# EAGLE design working (EAGLE 8.7.0)
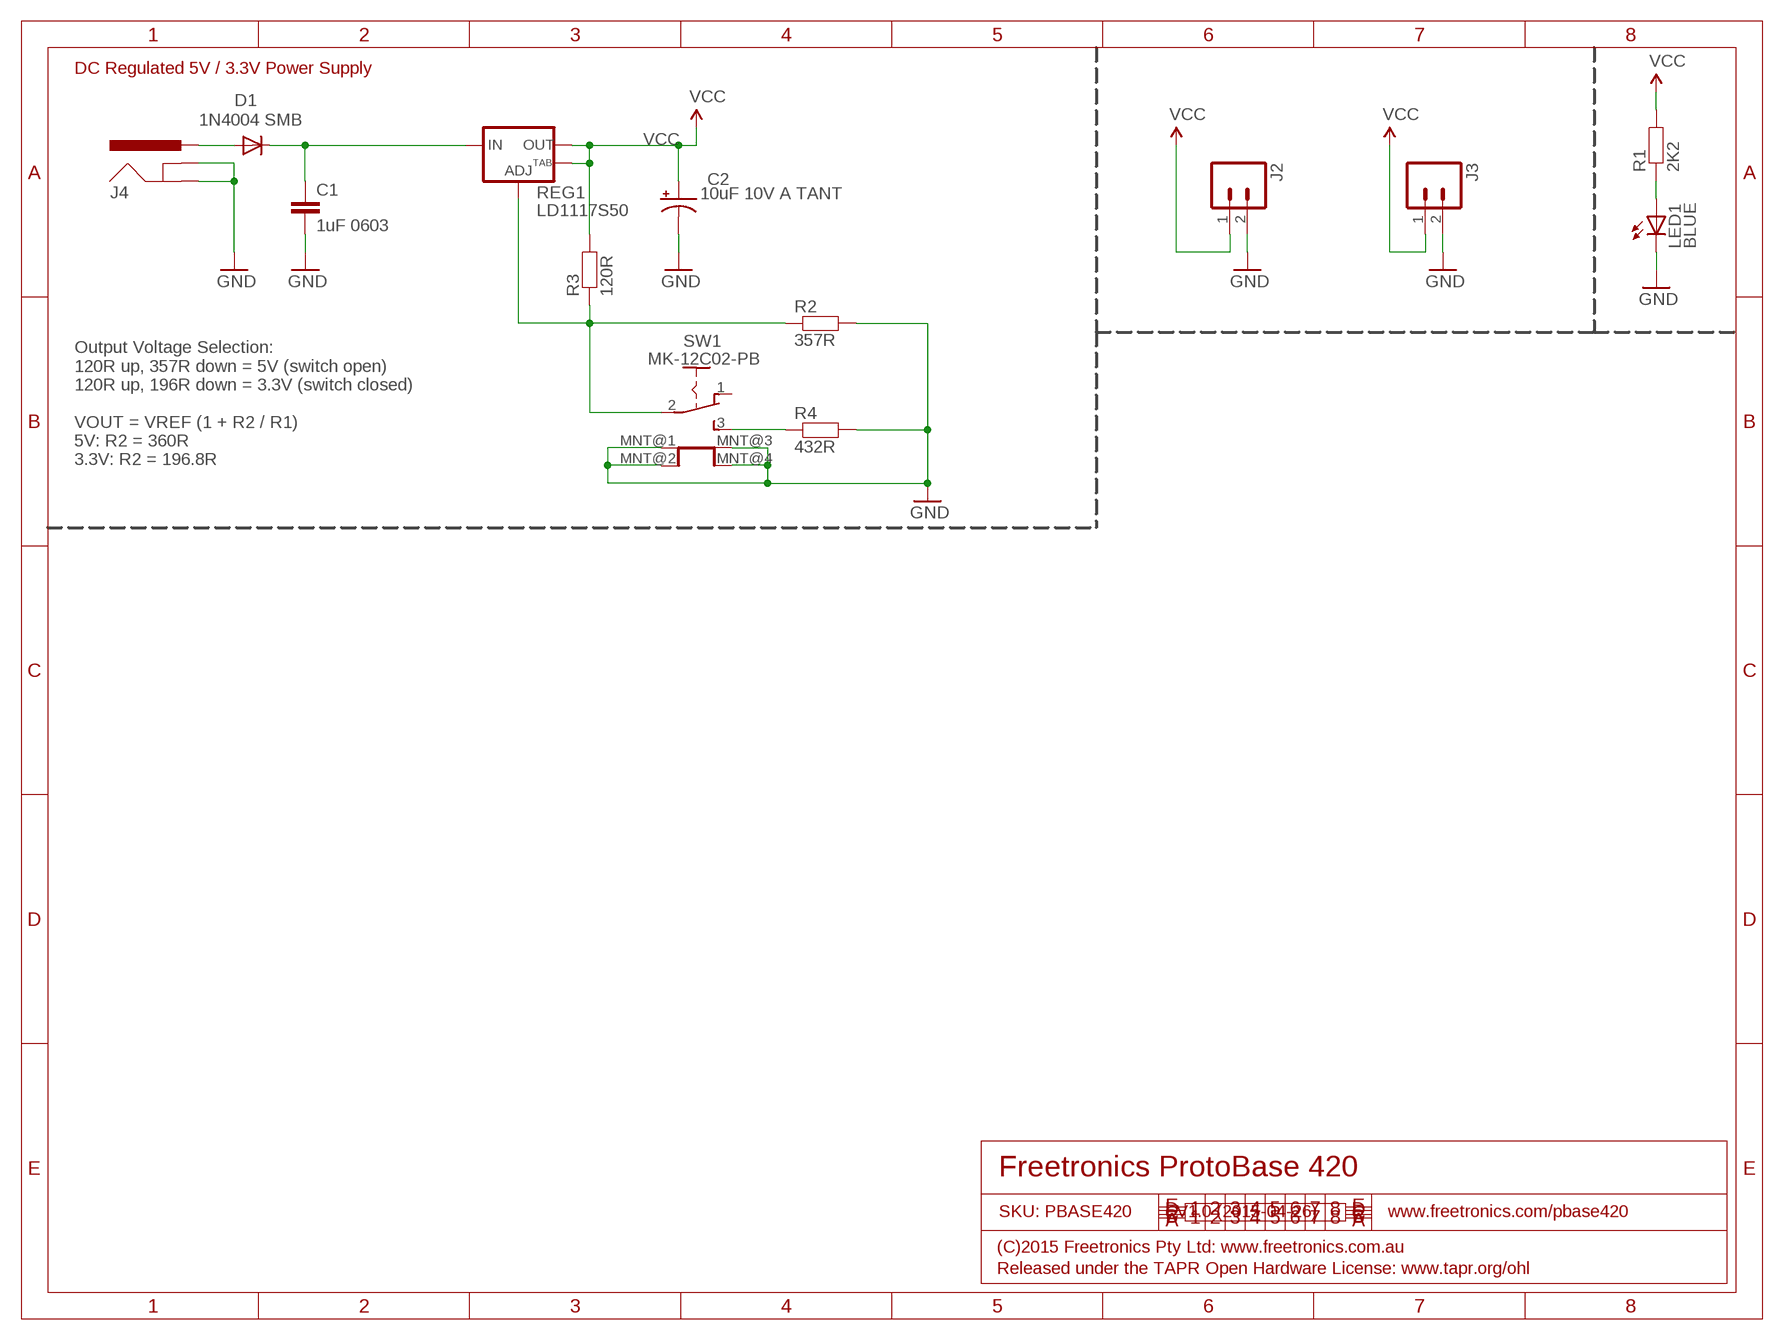
[diagram p0: schematic, sheet 1]

## Parts
C1  1uF 0603  CAP0603  [0603]
C2  10uF 10V A TANT  CAP_POL1206  [EIA3216]
D1  1N4004 SMB  DIODESMB  [SMB-DIODE]
J2  M02PTH  [1X02]
J3  M02PTH  [1X02]
J4  POWER_JACKPTH_SLOTS  [POWER_JACK_PTH_SLOTS]
LED1  BLUE  LED0603  [LED-0603]
R1  2K2  RESISTOR0603  [0603]
R2  357R  RESISTOR0603  [0603]
R3  120R  RESISTOR0603  [0603]
R4  432R  RESISTOR0603  [0603]
REG1  LD1117S50  V_REG_LM1117SOT223  [SOT223]
SW1  MK-12C02-PB  SWITCH-SPDT-4TABSSMT  [MK-12C02]

## Nets
GND: C1.2 C2.C(-) J2.2 J3.2 J4.GND J4.GNDBREAK LED1.C R2.2 R4.2 SW1.MNT@1(MNT) SW1.MNT@2(MNT) SW1.MNT@3(MNT) SW1.MNT@4(MNT)
N$1: LED1.A R1.1
N$2: R2.1 R3.1 REG1.1(ADJ) SW1.2(COM)
N$3: R4.1 SW1.3(B)
N$8: D1.A J4.PWR
VCC: C2.A(+) J2.1 J3.1 R1.2 R3.2 REG1.2(OUT) REG1.4(OUT)
VIN: C1.1 D1.C REG1.3(IN)
Unconnected: SW1.1(A)

## Notes on the sheet
- DC Regulated 5V / 3.3V Power Supply
- Output Voltage Selection:
  120R up, 357R down = 5V (switch open)
  120R up, 196R down = 3.3V (switch closed)
  
  VOUT = VREF (1 + R2 / R1)
  5V: R2 = 360R
  3.3V: R2 = 196.8R
- Freetronics ProtoBase 420
- SKU: PBASE420 | V1.0 (2015-04-26) | www.freetronics.com/pbase420
- (C)2015 Freetronics Pty Ltd: www.freetronics.com.au
- Released under the TAPR Open Hardware License: www.tapr.org/ohl

## Library data of the parts
C1 = freetronics-master-v1.1:CAP: Capacitor Standard 0603 ceramic capacitor, and 0.1" leaded capacitor.
C2 = freetronics:CAP_POL: Capacitor Polarized These are standard SMD and PTH capacitors. Normally 10uF, 47uF, and 100uF in electrolytic and tantalum varieties. Always verify the external diameter of the through hole cap, it varies with capacity, voltage, and manufacturer. The EIA devices should be standard.
D1 = freetronics:DIODE: Diode These are standard reverse protection diodes and small signal diodes. SMA package can handle up to about 1A. SOD-323 can handle about 200mA. What the SOD-323 package when ordering, there are some mfgs out there that are 5-pin packages.
J2 J3 = freetronics-original:M02: Header 2 Standard 2-pin 0.1" header. Use with straight break away headers (SKU : PRT-00116), right angle break away headers (PRT-00553), swiss pins (PRT-00743), machine pins (PRT-00117), and female headers (PRT-00115). Molex polarized connector foot print use with SKU : PRT-08233 with associated crimp pins and housings.
J4 = freetronics-jon:POWER_JACK: Power Jack This is the standard 5.5mm barrel jack for power. The PTH is the most common, proven, reliable, footprint. All others are experimental. The Slot footprint only works if the mill layer is transmitted to the PCB fab house so be warned. Spark Fun Electronics SKU : PRT-00119. Mating wall wart : TOL-00298 (and others)
LED1 = freetronics-jon:LED: LEDs Standard schematic elements and footprints for 5mm, 3mm, 1206, and 0603 sized LEDs. 5mm - Spark Fun Electronics SKU : COM-00529 (and others)
R1-R4 = freetronics-jon:RESISTOR: Resistor Basic schematic elements and footprints for 0603, 1206, and PTH 1/10th watt (small) resistors.
REG1 = freetronics-master-v1.1:V_REG_LM1117: Voltage Regulator LD1117 Adjustable low-dropout voltage regulator available in SOT89 and SOT223 SMT packages.
SW1 = freetronics-jon:SWITCH-SPDT-4TABS

## Net classes
0 default: width 0.152 mm, drill 0.241 mm, clearance 0.152 mm

## Board
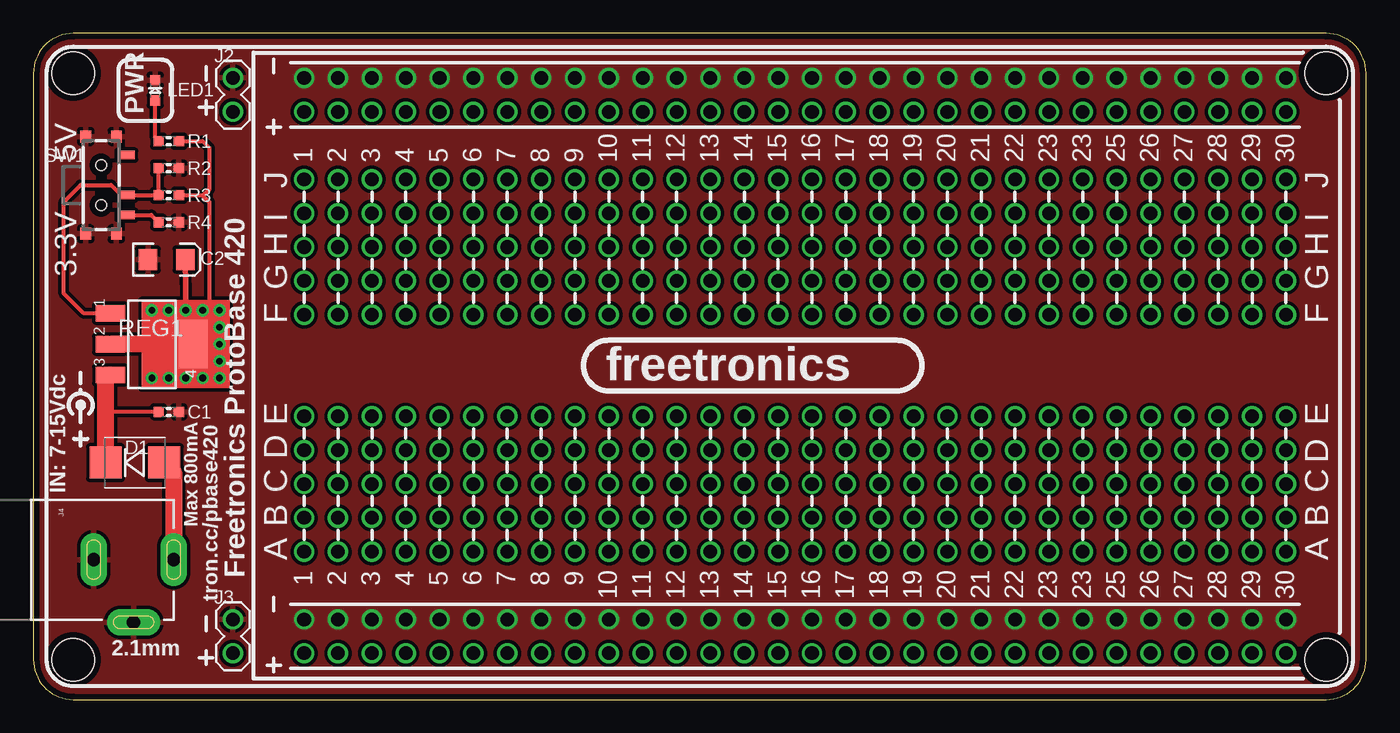
[diagram p1: board, top side]
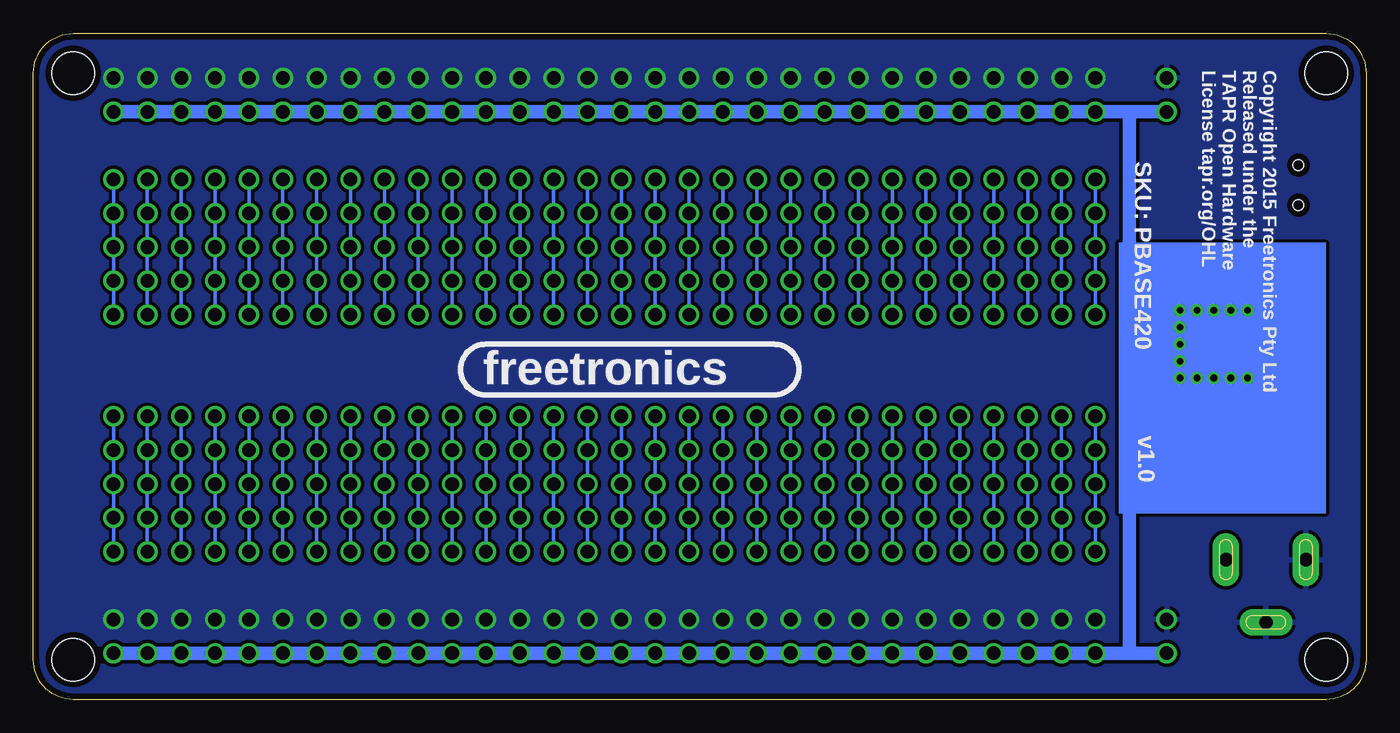
[diagram p2: board, bottom side, seen from below]

Size 100 x 50 mm. Coordinates in mm from the lower left corner, seen from the top.
Outline: 0,3 arc90 3,0 97,0 arc90 100,3 100,47 arc90 97,50 3,50 arc90 0,47 0,3
Copper layers (1*16): Top 0.035mm / dielectric 1.5mm / Bottom 0.035mm
Design rules "default": minimum track width 10mil, minimum drill 18mil, track to track 10mil, track to pad 10mil, pad to pad 10mil, via to via 10mil, smd to smd 8mil, copper to edge 18mil, drill to drill 8mil, minimum pad ring 10mil, minimum via ring 8mil, stop-mask expansion 4mil, vias tented up to drill 25mil, thermal gap 10mil
Holes 3.2 mm at 3,47 3,3 97,3 97,47

### Footprints (pad centres in the part's own frame; a part is rotated, then mirrored left to right if it is on the bottom)
0603 = smd 0.762 x 0.762: 1 -0.762,0; 2 0.762,0
EIA3216 = smd 1.4 x 1.6: A 1.4,0; C -1.4,0
SMB-DIODE = smd 2.4 x 2.4: A 2.2,0; C -2.2,0
1X02 = drill 1.016: 1 0,0; 2 2.54,0
POWER_JACK_PTH_SLOTS = drill 1 pad 2 long: GND 0,7.7; GNDBREAK 4.7,10.7; PWR 0,13.7
LED-0603 = smd 0.762 x 0.762: A -0.762,0; C 0.762,0
SOT223 = smd 1.219 x 2.235: 1 -2.311,-3.099; 2 0,-3.099; 3 2.311,-3.099 | smd 3.6 x 2.2: 4 0,3.099
MK-12C02 = smd 0.635 x 1.27: 1 -2.25,1.9; 2 0.75,1.9; 3 2.25,1.9 | smd 0.9 x 0.8: MNT@1 -3.65,1.15; MNT@2 -3.65,-1.15; MNT@3 3.65,1.15; MNT@4 3.65,-1.15 | hole 0.8: -1.5,0; 1.5,0

### Placement (x,y rotation side)
C1  10.16,21.59 0 top
C2  10,33.02 0 top
D1  7.62,17.78 0 top
J2  14.97,44.12 90 top
J3  14.97,3.48 90 top
J4  -3.17,10.5 270 top
LED1  9.14,45.72 90 top
R1  10.16,41.91 0 top
R2  10.16,39.88 0 top
R3  10.16,37.85 0 top
R4  10.16,35.81 0 top
REG1  8.89,26.67 270 top
SW1  5.08,38.61 270 top

### Tracks (layer width: path | path; a pad name or v marks a point on that pad's centre or on a via)
GND  (via drill 1.02)
  other vias: 20.32,6.01 22.86,6.01 25.4,6.01 27.94,6.01 30.48,6.01 33.02,6.01 35.56,6.01 38.1,6.01 40.64,6.01 43.18,6.01 45.72,6.01 48.26,6.01 50.8,6.01 53.34,6.01 55.88,6.01 58.42,6.01 60.96,6.01 63.5,6.01 66.04,6.01 68.58,6.01 71.12,6.01 73.66,6.01 76.2,6.01 78.74,6.01 81.28,6.01 83.82,6.01 86.36,6.01 88.9,6.01 91.44,6.01 93.98,6.01 20.32,46.66 22.86,46.66 25.4,46.66 27.94,46.66 30.48,46.66 33.02,46.66 35.56,46.66 38.1,46.66 40.64,46.66 43.18,46.66 45.72,46.66 48.26,46.66 50.8,46.66 53.34,46.66 55.88,46.66 58.42,46.66 60.96,46.66 63.5,46.66 66.04,46.66 68.58,46.66 71.12,46.66 73.66,46.66 76.2,46.66 78.74,46.66 81.28,46.66 83.82,46.66 86.36,46.66 88.9,46.66 91.44,46.66 93.98,46.66
  pour Bottom: 0,47 arc-90 3,50 97,50 arc-90 100,47 100,3 arc-74 97,0 3,0 arc-90 0,3
  pour Top: 0,47 arc-90 3,50 97,50 arc-90 100,47 100,3 arc-74 97,0 3,0 arc-90 0,3
N$1
  Top 0.254: R1.1 9.14,42.16
  Top 0.305: 9.14,42.16 LED1.A
N$2
  Top 0.254: 9.39,37.86 R3.1 | 6.59,37.86 SW1.2
  Top 0.305: REG1.1 3.79,28.98 2.29,30.48 2.29,37.34 3.56,38.61 5.84,38.61 6.59,37.86 | R3.1 R2.1 | SW1.2 9.39,37.86
N$3
  Top 0.305: SW1.3 8.85,36.36 R4.1
N$8
  Top 1.27: D1.A 10.53,17.07 J4.PWR
NL1  (via drill 1.02)
  Bottom 0.254: v20.32,21.25 v20.32,18.71 v20.32,16.18 v20.32,13.63 v20.32,11.1
NL2  (via drill 1.02)
  Bottom 0.254: v22.86,21.25 v22.86,18.71 v22.86,16.18 v22.86,13.63 v22.86,11.1
NL3  (via drill 1.02)
  Bottom 0.254: v25.4,21.25 v25.4,18.71 v25.4,16.18 v25.4,13.63 v25.4,11.1
NL4  (via drill 1.02)
  Bottom 0.254: v27.94,21.25 v27.94,18.71 v27.94,16.18 v27.94,13.63 v27.94,11.1
NL5  (via drill 1.02)
  Bottom 0.254: v30.48,21.25 v30.48,18.71 v30.48,16.18 v30.48,13.63 v30.48,11.1
NL6  (via drill 1.02)
  Bottom 0.254: v33.02,21.25 v33.02,18.71 v33.02,16.18 v33.02,13.63 v33.02,11.1
NL7  (via drill 1.02)
  Bottom 0.254: v35.56,21.25 v35.56,18.71 v35.56,16.18 v35.56,13.63 v35.56,11.1
NL8  (via drill 1.02)
  Bottom 0.254: v38.1,21.25 v38.1,18.71 v38.1,16.18 v38.1,13.63 v38.1,11.1
NL9  (via drill 1.02)
  Bottom 0.254: v40.64,21.25 v40.64,18.71 v40.64,16.18 v40.64,13.63 v40.64,11.1
NL10  (via drill 1.02)
  Bottom 0.254: v43.18,21.25 v43.18,18.71 v43.18,16.18 v43.18,13.63 v43.18,11.1
NL11  (via drill 1.02)
  Bottom 0.254: v45.72,21.25 v45.72,18.71 v45.72,16.18 v45.72,13.63 v45.72,11.1
NL12  (via drill 1.02)
  Bottom 0.254: v48.26,21.25 v48.26,18.71 v48.26,16.18 v48.26,13.63 v48.26,11.1
NL13  (via drill 1.02)
  Bottom 0.254: v50.8,21.25 v50.8,18.71 v50.8,16.18 v50.8,13.63 v50.8,11.1
NL14  (via drill 1.02)
  Bottom 0.254: v53.34,21.25 v53.34,18.71 v53.34,16.18 v53.34,13.63 v53.34,11.1
NL15  (via drill 1.02)
  Bottom 0.254: v55.88,21.25 v55.88,18.71 v55.88,16.18 v55.88,13.63 v55.88,11.1
NL16  (via drill 1.02)
  Bottom 0.254: v58.42,21.25 v58.42,18.71 v58.42,16.18 v58.42,13.63 v58.42,11.1
NL17  (via drill 1.02)
  Bottom 0.254: v60.96,21.25 v60.96,18.71 v60.96,16.18 v60.96,13.63 v60.96,11.1
NL18  (via drill 1.02)
  Bottom 0.254: v63.5,21.25 v63.5,18.71 v63.5,16.18 v63.5,13.63 v63.5,11.1
NL19  (via drill 1.02)
  Bottom 0.254: v66.04,21.25 v66.04,18.71 v66.04,16.18 v66.04,13.63 v66.04,11.1
NL20  (via drill 1.02)
  Bottom 0.254: v68.58,21.25 v68.58,18.71 v68.58,16.18 v68.58,13.63 v68.58,11.1
NL21  (via drill 1.02)
  Bottom 0.254: v71.12,21.25 v71.12,18.71 v71.12,16.18 v71.12,13.63 v71.12,11.1
NL22  (via drill 1.02)
  Bottom 0.254: v73.66,21.25 v73.66,18.71 v73.66,16.18 v73.66,13.63 v73.66,11.1
NL23  (via drill 1.02)
  Bottom 0.254: v76.2,21.25 v76.2,18.71 v76.2,16.18 v76.2,13.63 v76.2,11.1
NL24  (via drill 1.02)
  Bottom 0.254: v78.74,21.25 v78.74,18.71 v78.74,16.18 v78.74,13.63 v78.74,11.1
NL25  (via drill 1.02)
  Bottom 0.254: v81.28,21.25 v81.28,18.71 v81.28,16.18 v81.28,13.63 v81.28,11.1
NL26  (via drill 1.02)
  Bottom 0.254: v83.82,21.25 v83.82,18.71 v83.82,16.18 v83.82,13.63 v83.82,11.1
NL27  (via drill 1.02)
  Bottom 0.254: v86.36,21.25 v86.36,18.71 v86.36,16.18 v86.36,13.63 v86.36,11.1
NL28  (via drill 1.02)
  Bottom 0.254: v88.9,21.25 v88.9,18.71 v88.9,16.18 v88.9,13.63 v88.9,11.1
NL29  (via drill 1.02)
  Bottom 0.254: v91.44,21.25 v91.44,18.71 v91.44,16.18 v91.44,13.63 v91.44,11.1
NL30  (via drill 1.02)
  Bottom 0.254: v93.98,21.25 v93.98,18.71 v93.98,16.18 v93.98,13.63 v93.98,11.1
NR1  (via drill 1.02)
  Bottom 0.254: v20.32,39.03 v20.32,36.49 v20.32,33.95 v20.32,31.41 v20.32,28.88
NR2  (via drill 1.02)
  Bottom 0.254: v22.86,39.03 v22.86,36.49 v22.86,33.95 v22.86,31.41 v22.86,28.88
NR3  (via drill 1.02)
  Bottom 0.254: v25.4,39.03 v25.4,36.49 v25.4,33.95 v25.4,31.41 v25.4,28.88
NR4  (via drill 1.02)
  Bottom 0.254: v27.94,39.03 v27.94,36.49 v27.94,33.95 v27.94,31.41 v27.94,28.88
NR5  (via drill 1.02)
  Bottom 0.254: v30.48,39.03 v30.48,36.49 v30.48,33.95 v30.48,31.41 v30.48,28.88
NR6  (via drill 1.02)
  Bottom 0.254: v33.02,39.03 v33.02,36.49 v33.02,33.95 v33.02,31.41 v33.02,28.88
NR7  (via drill 1.02)
  Bottom 0.254: v35.56,39.03 v35.56,36.49 v35.56,33.95 v35.56,31.41 v35.56,28.88
NR8  (via drill 1.02)
  Bottom 0.254: v38.1,39.03 v38.1,36.49 v38.1,33.95 v38.1,31.41 v38.1,28.88
NR9  (via drill 1.02)
  Bottom 0.254: v40.64,39.03 v40.64,36.49 v40.64,33.95 v40.64,31.41 v40.64,28.88
NR10  (via drill 1.02)
  Bottom 0.254: v43.18,39.03 v43.18,36.49 v43.18,33.95 v43.18,31.41 v43.18,28.88
NR11  (via drill 1.02)
  Bottom 0.254: v45.72,39.03 v45.72,36.49 v45.72,33.95 v45.72,31.41 v45.72,28.88
NR12  (via drill 1.02)
  Bottom 0.254: v48.26,39.03 v48.26,36.49 v48.26,33.95 v48.26,31.41 v48.26,28.88
NR13  (via drill 1.02)
  Bottom 0.254: v50.8,39.03 v50.8,36.49 v50.8,33.95 v50.8,31.41 v50.8,28.88
NR14  (via drill 1.02)
  Bottom 0.254: v53.34,39.03 v53.34,36.49 v53.34,33.95 v53.34,31.41 v53.34,28.88
NR15  (via drill 1.02)
  Bottom 0.254: v55.88,39.03 v55.88,36.49 v55.88,33.95 v55.88,31.41 v55.88,28.88
NR16  (via drill 1.02)
  Bottom 0.254: v58.42,39.03 v58.42,36.49 v58.42,33.95 v58.42,31.41 v58.42,28.88
NR17  (via drill 1.02)
  Bottom 0.254: v60.96,39.03 v60.96,36.49 v60.96,33.95 v60.96,31.41 v60.96,28.88
NR18  (via drill 1.02)
  Bottom 0.254: v63.5,39.03 v63.5,36.49 v63.5,33.95 v63.5,31.41 v63.5,28.88
NR19  (via drill 1.02)
  Bottom 0.254: v66.04,39.03 v66.04,36.49 v66.04,33.95 v66.04,31.41 v66.04,28.88
NR20  (via drill 1.02)
  Bottom 0.254: v68.58,39.03 v68.58,36.49 v68.58,33.95 v68.58,31.41 v68.58,28.88
NR21  (via drill 1.02)
  Bottom 0.254: v71.12,39.03 v71.12,36.49 v71.12,33.95 v71.12,31.41 v71.12,28.88
NR22  (via drill 1.02)
  Bottom 0.254: v73.66,39.03 v73.66,36.49 v73.66,33.95 v73.66,31.41 v73.66,28.88
NR23  (via drill 1.02)
  Bottom 0.254: v76.2,39.03 v76.2,36.49 v76.2,33.95 v76.2,31.41 v76.2,28.88
NR24  (via drill 1.02)
  Bottom 0.254: v78.74,39.03 v78.74,36.49 v78.74,33.95 v78.74,31.41 v78.74,28.88
NR25  (via drill 1.02)
  Bottom 0.254: v81.28,39.03 v81.28,36.49 v81.28,33.95 v81.28,31.41 v81.28,28.88
NR26  (via drill 1.02)
  Bottom 0.254: v83.82,39.03 v83.82,36.49 v83.82,33.95 v83.82,31.41 v83.82,28.88
NR27  (via drill 1.02)
  Bottom 0.254: v86.36,39.03 v86.36,36.49 v86.36,33.95 v86.36,31.41 v86.36,28.88
NR28  (via drill 1.02)
  Bottom 0.254: v88.9,39.03 v88.9,36.49 v88.9,33.95 v88.9,31.41 v88.9,28.88
NR29  (via drill 1.02)
  Bottom 0.254: v91.44,39.03 v91.44,36.49 v91.44,33.95 v91.44,31.41 v91.44,28.88
NR30  (via drill 1.02)
  Bottom 0.254: v93.98,39.03 v93.98,36.49 v93.98,33.95 v93.98,31.41 v93.98,28.88
VCC  (via drill 0.5, 1.02)
  Top 0.254: v8.89,29.21 v10.16,29.21 v11.43,29.21 v12.7,29.21 13.21,29.21 v13.97,29.21 v13.97,27.94 | v13.97,27.94 v13.97,26.67 v13.97,25.4 v13.97,24.13 v12.7,24.13 v11.43,24.13 v10.16,24.13 v8.89,24.13 | v13.97,27.94 13.26,27.94 | 12.75,37.85 12.75,37.8
  Top 0.305: R3.2 12.75,37.85 13.21,38.3 13.21,41.4 12.7,41.91 R1.2 | 12.75,37.8 13.21,37.34 13.21,29.21
  Top 0.406: v11.43,29.21 11.43,31.24 11.4,32.77 C2.A
  Top 0.813: 13.26,27.94 REG1.4
  Top 1.27: REG1.4 REG1.2
  Bottom 1.016: v93.98,44.12 v91.44,44.12 v88.9,44.12 v86.36,44.12 v83.82,44.12 v81.28,44.12 v78.74,44.12 v76.2,44.12 v73.66,44.12 v71.12,44.12 v68.58,44.12 v66.04,44.12 v63.5,44.12 v60.96,44.12 v58.42,44.12 v55.88,44.12 v53.34,44.12 v50.8,44.12 v48.26,44.12 v45.72,44.12 v43.18,44.12 v40.64,44.12 v38.1,44.12 v35.56,44.12 v33.02,44.12 v30.48,44.12 v27.94,44.12 v25.4,44.12 v22.86,44.12 v20.32,44.12 17.78,44.12 | v93.98,3.48 v91.44,3.48 v88.9,3.48 v86.36,3.48 v83.82,3.48 v81.28,3.48 v78.74,3.48 v76.2,3.48 v73.66,3.48 v71.12,3.48 v68.58,3.48 v66.04,3.48 v63.5,3.48 v60.96,3.48 v58.42,3.48 v55.88,3.48 v53.34,3.48 v50.8,3.48 v48.26,3.48 v45.72,3.48 v43.18,3.48 v40.64,3.48 v38.1,3.48 v35.56,3.48 v33.02,3.48 v30.48,3.48 v27.94,3.48 v25.4,3.48 v22.86,3.48 v20.32,3.48 17.78,3.48 | 17.78,44.12 J2.1 | 17.78,3.48 17.78,20.32 v13.97,24.13 | J3.1 17.78,3.48 | v13.97,29.21 17.78,33.02 17.78,44.12
VIN
  Top 0.305: C1.1 5.42,21.59
  Top 0.813: 5.45,24.02 5.42,24.02
  Top 1.27: D1.C 5.42,21.59 5.42,24.02 | REG1.3 5.45,24.02
(copper drawn outside any net)
  shapes: Bottom area x1, Top area x1

### Text on the board
tPlace: PWR | 5V | 1 | 2 | 3 | 4 | 5 | 6 | 7 | 8 | 9 | 10 | 11 | 12 | 13 | 14 | 15 | 16 | 17 | 18 | 19 | 20 | 21 | 22 | 23 | 23 | 25 | 26 | 27 | 28 | 29 | 30 | J | J | I | I | H | H | 3.3V | G | G | F | F | freetronics | E | E | D | D | C | C | IN: 7-15Vdc | Max 800mA | B | B | A | A | Freetronics ProtoBase 420 | 1 | 2 | 3 | 4 | 5 | 6 | 7 | 8 | 9 | 10 | 11 | 12 | 13 | 14 | 15 | 16 | 17 | 18 | 19 | 20 | 21 | 22 | 23 | 23 | 25 | 26 | 27 | 28 | 29 | 30 | tron.cc/pbase420 | 2.1mm
bPlace: Copyright 2015 Freetronics Pty Ltd / Released under the / TAPR Open Hardware / License tapr.org/OHL | SKU: PBASE420 | freetronics | v1.0